# Altium project stmg431rb.PrjPcb
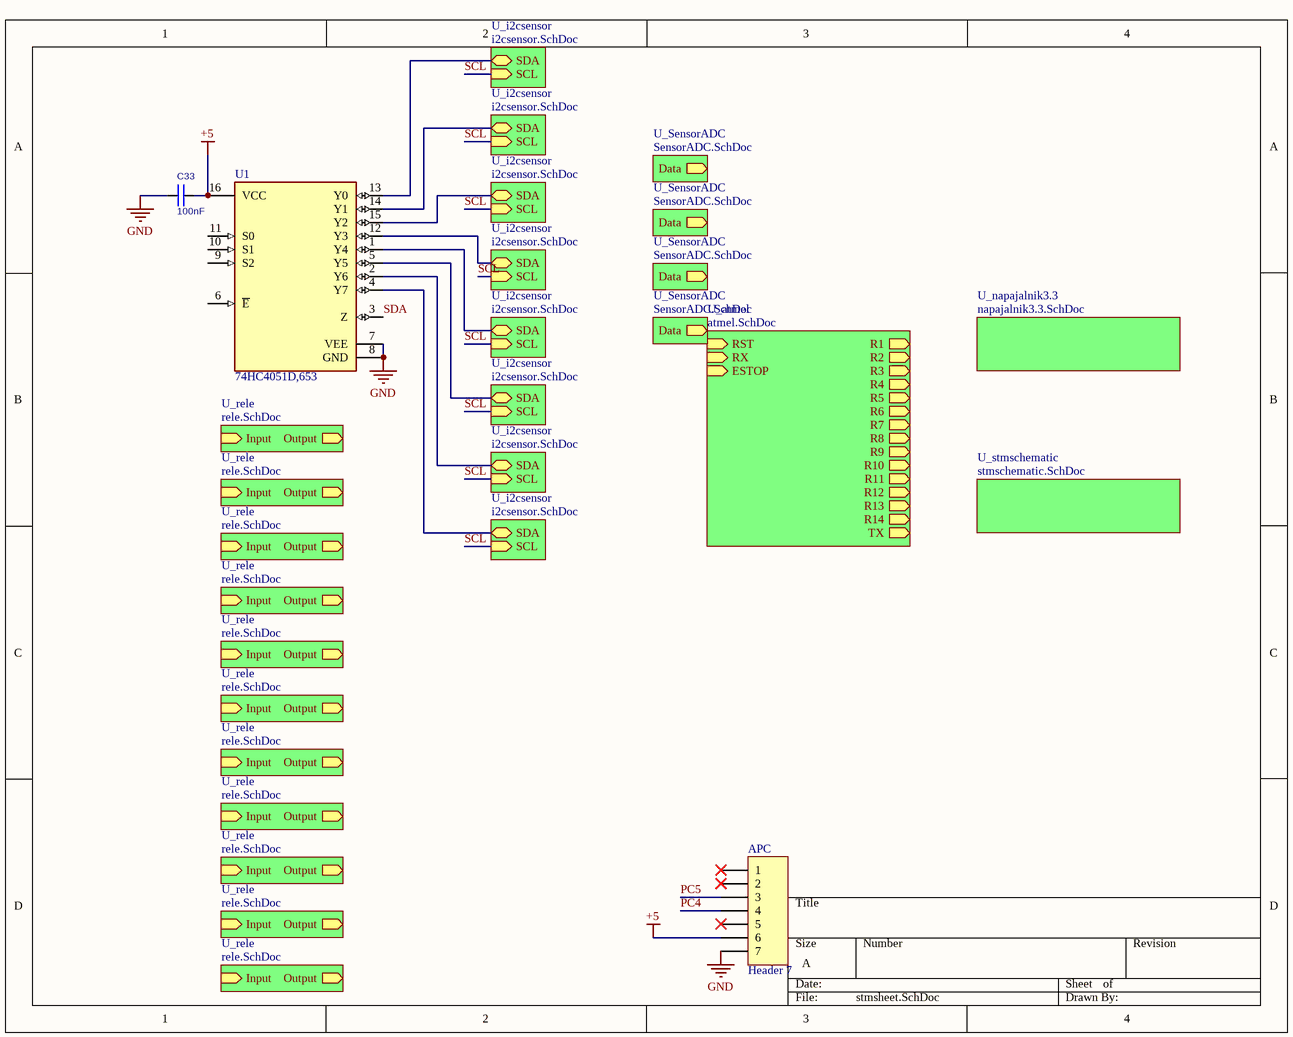
[diagram p0: stmsheet.SchDoc]
8 sheets, 154 parts. Net scope: hierarchical (ports join the sheet entries above them; power ports are global).
Board file: stmsheet.PcbDoc
Sheets:
  stmsheet.SchDoc
    U_atmel = atmel.SchDoc
    U_rele = rele.SchDoc
    U_rele = rele.SchDoc
    U_rele = rele.SchDoc
    U_rele = rele.SchDoc
    U_rele = rele.SchDoc
    U_rele = rele.SchDoc
    U_rele = rele.SchDoc
    U_rele = rele.SchDoc
    U_rele = rele.SchDoc
    U_rele = rele.SchDoc
    U_rele = rele.SchDoc
    U_SensorADC = SensorADC.SchDoc
    U_SensorADC = SensorADC.SchDoc
    U_SensorADC = SensorADC.SchDoc
    U_SensorADC = SensorADC.SchDoc
    U_napajalnik3.3 = napajalnik3.3.SchDoc
    U_i2csensor = i2csensor.SchDoc
    U_i2csensor = i2csensor.SchDoc
    U_i2csensor = i2csensor.SchDoc
    U_i2csensor = i2csensor.SchDoc
    U_i2csensor = i2csensor.SchDoc
    U_i2csensor = i2csensor.SchDoc
    U_i2csensor = i2csensor.SchDoc
    U_i2csensor = i2csensor.SchDoc
    U_stmschematic = stmschematic.SchDoc
      U_CAN = CAN.SchDoc

## Sheet stmsheet.SchDoc
size A; SheetNumber: 1; SheetTotal: 8

### Parts
APC  Header 7  [HDR1X7]
C33  100nF  [C0603]
U1  74HC4051D,653  [FP-SOT109-1-IPC_B]

### Sub-sheets
U_atmel = atmel.SchDoc: RST (in), R6 (out), R4 (out), R5 (out), R8 (out), R2 (out), R3 (out), R1 (out), R7 (out), TX (out), RX (in), ESTOP (in), R9 (out), R10 (out), R11 (out), R12 (out), R13 (out), R14 (out)
U_i2csensor = i2csensor.SchDoc: SDA (bidir), SCL (in)
U_i2csensor = i2csensor.SchDoc: SDA (bidir), SCL (in)
U_i2csensor = i2csensor.SchDoc: SDA (bidir), SCL (in)
U_i2csensor = i2csensor.SchDoc: SDA (bidir), SCL (in)
U_i2csensor = i2csensor.SchDoc: SDA (bidir), SCL (in)
U_i2csensor = i2csensor.SchDoc: SDA (bidir), SCL (in)
U_i2csensor = i2csensor.SchDoc: SDA (bidir), SCL (in)
U_i2csensor = i2csensor.SchDoc: SDA (bidir), SCL (in)
U_napajalnik3.3 = napajalnik3.3.SchDoc: no entries
U_rele = rele.SchDoc: Input (in), Output (out)
U_rele = rele.SchDoc: Input (in), Output (out)
U_rele = rele.SchDoc: Input (in), Output (out)
U_rele = rele.SchDoc: Input (in), Output (out)
U_rele = rele.SchDoc: Input (in), Output (out)
U_rele = rele.SchDoc: Input (in), Output (out)
U_rele = rele.SchDoc: Input (in), Output (out)
U_rele = rele.SchDoc: Input (in), Output (out)
U_rele = rele.SchDoc: Input (in), Output (out)
U_rele = rele.SchDoc: Input (in), Output (out)
U_rele = rele.SchDoc: Input (in), Output (out)
U_SensorADC = SensorADC.SchDoc: Data (out)
U_SensorADC = SensorADC.SchDoc: Data (out)
U_SensorADC = SensorADC.SchDoc: Data (out)
U_SensorADC = SensorADC.SchDoc: Data (out)
U_stmschematic = stmschematic.SchDoc: no entries

### Nets
+5: APC.6 C33.2 U1.16(VCC)
GND: APC.7 C33.1 U1.7(VEE) U1.8(GND)
PC4: APC.4
PC5: APC.3
SCL: sheet U_i2csensor/SCL, sheet U_i2csensor/SCL, sheet U_i2csensor/SCL, sheet U_i2csensor/SCL, sheet U_i2csensor/SCL, sheet U_i2csensor/SCL, sheet U_i2csensor/SCL, sheet U_i2csensor/SCL
SDA: U1.3(Z)
Netpressure1_U_i2csensor1_1: U1.13(Y0) ; sheet U_i2csensor/SDA
Netpressure1_U_i2csensor2_1: U1.14(Y1) ; sheet U_i2csensor/SDA
Netpressure1_U_i2csensor3_1: U1.15(Y2) ; sheet U_i2csensor/SDA
Netpressure1_U_i2csensor4_1: U1.12(Y3) ; sheet U_i2csensor/SDA
Netpressure1_U_i2csensor5_1: U1.1(Y4) ; sheet U_i2csensor/SDA
Netpressure1_U_i2csensor6_1: U1.5(Y5) ; sheet U_i2csensor/SDA
Netpressure1_U_i2csensor7_1: U1.2(Y6) ; sheet U_i2csensor/SDA
Netpressure1_U_i2csensor8_1: U1.4(Y7) ; sheet U_i2csensor/SDA

Not connected (* = marked no-connect by the designer): APC 1* 2* 5*; U1 6(~{E}) 9(S2) 10(S1) 11(S0)

### Library data of the parts
APC = Header 7: Header, 7-Pin; LatestRevisionDate: 17-Jul-2002; LatestRevisionNote: Re-released for DXP Platform.; Publisher: Altium Limited
C33 = C: Capacitor; Value: 100nF
U1 = CMP-14339-000003-1: IC MUX/DEMUX 8X1 16SOIC

## Sheet atmel.SchDoc
size A4; SheetNumber: 4; SheetTotal: 7; SPICEModelCacheDHJLCGBX: <root> / <DocumentId>DHJLCGBX</DocumentId> / <CacheFrame Number="0"> / <Model Name="0603_150060as75000" Kind="CKT"> / <Text>************************************************** / * Manufacturer:           Wurth Elektronik / * Kinds:                  SMT Mono-color Chip LED Waterclear / * Matchcode:              WL-SMCW / * Library Type:           LTspice / * Version:                rev22a / * Created/modified by:    Ella / * Date and Time:          2022-02-18 / * Team:                   eiSos EDA Service / * Contact:                libraries@we-online.com / ************************************************** / * Copyright(C) 2022 WĂĽrth Elektronik eiSos GmbH &amp; Co. KG / * All Rights Reserved. / ************************************************** / * Disclaimer: While WĂĽrth Elektronik eiSos has made every reasonable effort to ensure the accuracy / * of the simulation models provided, WĂĽrth Elektronik eiSos does not guarantee the exemption of error on / * the simulation models, nor does WĂĽrth Elektronik eiSos guarantee that the simulation model is current. / * WĂĽrth Elektronik eiSos reserves the right to make any adjustments at any time without notice. / * WĂĽrth Elektronik eiSos expressly disclaims all implied warranties regarding this simulation model. / ************************************************** / .subckt 0603_150060AS75000  1  2 / D1 1 2 SMCW / .MODEL SMCW D / + IS=10.010E-21 / + N=1.8643 / + RS=1.0000E-6 / + IKF=999 / + CJO=1.0000E-12 / + M=.3333 / + VJ=.75 / + BV=100 / + TT=5.0000E-9 / .ends</Text> / </Model> / </CacheFrame> / </root>
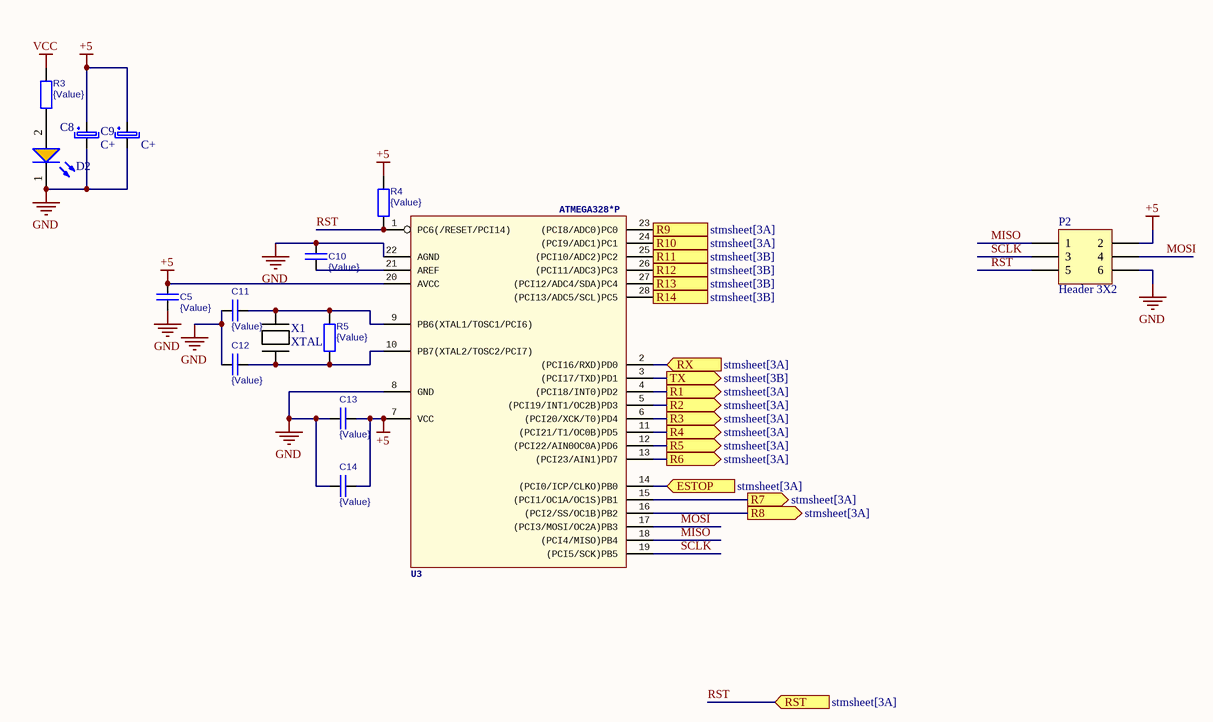
[diagram p1: atmel.SchDoc]

### Parts
(Parts that share a designator on the sheet are numbered #1, #2 ... from top to bottom, then left to right.)
C5  {Value}  [C0603]
C8  C+  [C AlElko 5x11 R2]
C9  C+  [C AlElko 5x11 R2]
C10  {Value}  [C0603]
C11  {Value}  [C0603]
C12  {Value}  [C0603]
C13  {Value}  [C0603]
C14  {Value}  [C0603]
D2  Amber, 2V, 140°  [WL-SMCW_0603_150060xx75000]  (value not drawn)
P2  Header 3X2  [HDR2X3]
R3#1  {Value}  [R0603]
R4  {Value}  [R0603]
R5  {Value}  [R0603]
U3  ATMEGA328*P  [DIL28-3]
X1  XTAL  [XTAL]

### Ports
ESTOP (in, see stmsheet[3A]), R1 (out, see stmsheet[3A]), R2 (out, see stmsheet[3A]), R3 (out, see stmsheet[3A]), R4 (out, see stmsheet[3A]), R5 (out, see stmsheet[3A]), R6 (out, see stmsheet[3A]), R7 (out, see stmsheet[3A]), R8 (out, see stmsheet[3A]), R9 (out, see stmsheet[3A]), R10 (out, see stmsheet[3A]), R11 (out, see stmsheet[3B]), R12 (out, see stmsheet[3B]), R13 (out, see stmsheet[3B]), R14 (out, see stmsheet[3B]), RST (in, see stmsheet[3A]), RX (in, see stmsheet[3A]), TX (out, see stmsheet[3B])

### Nets
+5: C5.1 C8.1 C9.1 C13.2 C14.2 P2.2 R4.1 U3.7(VCC) U3.20(AVCC)
GND: C5.2 C8.2 C9.2 C10.1 C11.1 C12.1 C13.1 C14.1 D2.1(K) P2.6 U3.8(GND) U3.22(AGND)
VCC: R3#1.1
MISO: P2.1 U3.18((PCI4/MISO)PB4)
MOSI: P2.4 U3.17((PCI3/MOSI/OC2A)PB3)
RST: P2.5 R4.2 U3.1(PC6(/RESET/PCI14)) ; port RST
SCLK: P2.3 U3.19((PCI5/SCK)PB5)
NetC10_2: C10.2 U3.21(AREF)
NetC11_2: C11.2 R5.1 U3.9(PB6(XTAL1/TOSC1/PCI6)) X1.2
NetC12_2: C12.2 R5.2 U3.10(PB7(XTAL2/TOSC2/PCI7)) X1.1
NetD2_2: D2.2(A) R3#1.2
NetU3_2: U3.2((PCI16/RXD)PD0) ; port RX
NetU3_3: U3.3((PCI17/TXD)PD1) ; port TX
NetU3_4: U3.4((PCI18/INT0)PD2) ; port R1
NetU3_5: U3.5((PCI19/INT1/OC2B)PD3) ; port R2
NetU3_6: U3.6((PCI20/XCK/T0)PD4) ; port R3
NetU3_11: U3.11((PCI21/T1/OC0B)PD5) ; port R4
NetU3_12: U3.12((PCI22/AIN0OC0A)PD6) ; port R5
NetU3_13: U3.13((PCI23/AIN1)PD7) ; port R6
NetU3_14: U3.14((PCI0/ICP/CLKO)PB0) ; port ESTOP
NetU3_15: U3.15((PCI1/OC1A/OC1S)PB1) ; port R7
NetU3_16: U3.16((PCI2/SS/OC1B)PB2) ; port R8
NetU3_23: U3.23((PCI8/ADC0)PC0) ; port R9
NetU3_24: U3.24((PCI9/ADC1)PC1) ; port R10
NetU3_25: U3.25((PCI10/ADC2)PC2) ; port R11
NetU3_26: U3.26((PCI11/ADC3)PC3) ; port R12
NetU3_27: U3.27((PCI12/ADC4/SDA)PC4) ; port R13
NetU3_28: U3.28((PCI13/ADC5/SCL)PC5) ; port R14

### Library data of the parts
C5 C10-C14 = C: Capacitor; Value: {Value}
C8 C9 = C+: Capacitor Polarized
D2 = 150060AS75000: WL-SMCW Mono-color Chip LED Waterclear, size 0603, Amber, 2V, 140°; Manufacturer: Wurth Elektronik; Case/Size Code: 0603; Chip Technology: AlInGaP; Dominant Wavelength: 605nm; Luminous Intensity: 130mcd; Peak Wavelength: 610nm; Manufacturer Part Number: 150060AS75000; Category: Signal LEDs; Match Code: WL-SMCW; ComponentLink1Description: Website Link; ComponentLink1URL: https://www.we-online.com/redexpert/article/150060AS75000?ad; ComponentLink2Description: Datasheet Link; ComponentLink2URL: https://www.we-online.com/redexpert/spec/150060AS75000?ad; Mount: Surface Mount; Operating Temperature Max: 85°C; Operating Temperature Min: -40°C; Packaging: Tape and Reel; Length: 1.6mm; Width: 0.8mm; Height: 0.7mm; Emitting Color: Amber; Forward Voltage: 2V; Viewing Angle: 140°
P2 = Header 3X2: Header, 3-Pin, Dual row; LatestRevisionDate: 17-Jul-2002; LatestRevisionNote: Re-released for DXP Platform.; Publisher: Altium Limited
R3#1 R4 R5 = R: Value: {Value}
U3 = ATMEGA328*P: GateName_1: G$1; SymbolName_1: MEGA328; LibraryName: atmega328; DeviceSetName: ATMEGA328*P; Package: DIL28-3

## Sheet rele.SchDoc
size A4; SheetNumber: 3; SheetTotal: 7
Used 11 times, as channels U_rele, U_rele, U_rele, U_rele, U_rele, U_rele, U_rele, U_rele, U_rele, U_rele, U_rele. Parts and nets are listed once, with the designators drawn on the sheet.
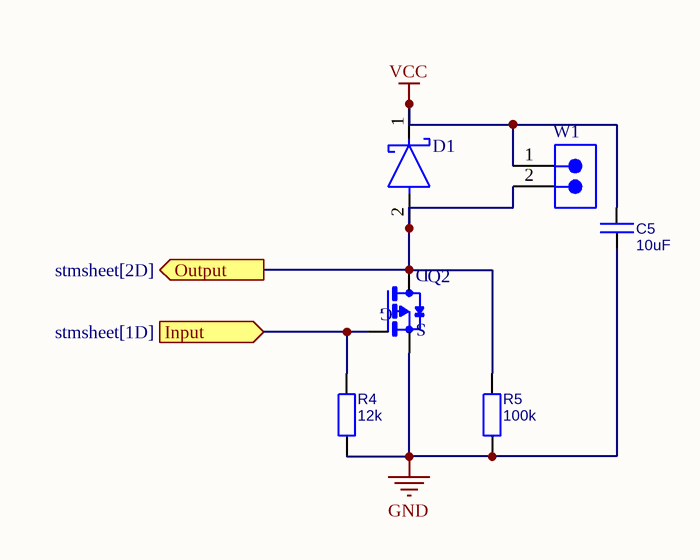
[diagram p2: rele.SchDoc]

### Parts
C5  10uF  [C0603]
D1  STPS0560Z  [FP-SOD-123-MFG]  (value not drawn)
Q2  SI2323DS-T1-GE3  [SOT23]  (value not drawn)
R4  12k  [R0603]
R5  100k  [R0603]
W1  (no value)  [691321100002]

### Ports
Input (in, see stmsheet[1D]), Output (out, see stmsheet[2D])

### Nets
GND: C5.2 Q2.2(S) R4.2 R5.2
VCC: C5.1 D1.1(C) W1.1
Input: Q2.1(G) R4.1 ; port Input
Output: D1.2(A) Q2.3(D) R5.1 W1.2 ; port Output

### Channels
U_rele: designators C5=C5_U_rele11 D1=D1_U_rele11 Q2=Q2_U_rele#1 R4=R4_U_rele11 R5=R5_U_rele11 W1=W1_U_rele11; ports Input=NetQ2_U_rele#1_1 Output=NetD1_U_rele11_2
U_rele: designators C5=C5_U_rele10 D1=D1_U_rele10 Q2=Q2_U_rele#2 R4=R4_U_rele10 R5=R5_U_rele10 W1=W1_U_rele10; ports Input=NetQ2_U_rele#2_1 Output=NetD1_U_rele10_2
U_rele: designators C5=C5_U_rele9 D1=D1_U_rele9 Q2=Q2_U_rele#3 R4=R4_U_rele9 R5=R5_U_rele9 W1=W1_U_rele9; ports Input=NetQ2_U_rele#3_1 Output=NetD1_U_rele9_2
U_rele: designators C5=C5_U_rele8 D1=D1_U_rele8 Q2=Q2_U_rele#4 R4=R4_U_rele8 R5=R5_U_rele8 W1=W1_U_rele8; ports Input=NetQ2_U_rele#4_1 Output=NetD1_U_rele8_2
U_rele: designators C5=C5_U_rele7 D1=D1_U_rele7 Q2=Q2_U_rele#5 R4=R4_U_rele7 R5=R5_U_rele7 W1=W1_U_rele7; ports Input=NetQ2_U_rele#5_1 Output=NetD1_U_rele7_2
U_rele: designators C5=C5_U_rele6 D1=D1_U_rele6 Q2=Q2_U_rele#6 R4=R4_U_rele6 R5=R5_U_rele6 W1=W1_U_rele6; ports Input=NetQ2_U_rele#6_1 Output=NetD1_U_rele6_2
U_rele: designators C5=C5_U_rele5 D1=D1_U_rele5 Q2=Q2_U_rele#7 R4=R4_U_rele5 R5=R5_U_rele5 W1=W1_U_rele5; ports Input=NetQ2_U_rele#7_1 Output=NetD1_U_rele5_2
U_rele: designators C5=C5_U_rele4 D1=D1_U_rele4 Q2=Q2_U_rele#8 R4=R4_U_rele4 R5=R5_U_rele4 W1=W1_U_rele4; ports Input=NetQ2_U_rele#8_1 Output=NetD1_U_rele4_2
U_rele: designators C5=C5_U_rele3 D1=D1_U_rele3 Q2=Q2_U_rele#9 R4=R4_U_rele3 R5=R5_U_rele3 W1=W1_U_rele3; ports Input=NetQ2_U_rele#9_1 Output=NetD1_U_rele3_2
U_rele: designators C5=C5_U_rele2 D1=D1_U_rele2 Q2=Q2_U_rele#10 R4=R4_U_rele2 R5=R5_U_rele2 W1=W1_U_rele2; ports Input=NetQ2_U_rele#10_1 Output=NetD1_U_rele2_2
U_rele: designators C5=C5_U_rele1 D1=D1_U_rele1 Q2=Q2_U_rele#11 R4=R4_U_rele1 R5=R5_U_rele1 W1=W1_U_rele1; ports Input=NetQ2_U_rele#11_1 Output=NetD1_U_rele1_2

### Library data of the parts
C5 = C: Capacitor; Value: 10uF
D1 = CMP-12187-000036-1: DIODE SCHOTTKY 60V 500MA SOD123; Additional Feature: FREE WHEELING DIODE; Polarity: Standard; Max Forward Surge Current (Ifsm): 5.5A; Number of Elements: 1; Max Reverse Current: 50uA; Diode Element Material: SILICON; Number of Terminals/Pins: 2; Package Body Material: Plastic; Element Configuration: Single; Forward Voltage: 660mV; Terminal Form: Gull Wing; Output Current: 500mA; Series: -; Package Quantity: 1; Max Reverse Voltage (DC): 60V; Width: 1.7mm; Voltage Rating (DC): 60V; Height: 1.35mm; Packaging: Tape and Reel; Max Repetitive Reverse Voltage (Vrrm): 60V; Max Surge Current: 5.5A; Package Shape: Rectangular; REACH SVHC: No SVHC; Average Rectified Current: 500mA; JESD-30 Code: R-PDSO-G2; Terminal Position: DUAL; RoHS Compliant: Yes; Surface Mount: Yes; Peak Non-Repetitive Surge Current: 5.5A; Contact Plating: Tin; Max Reverse Leakage Current: 50uA; Length: 2.85mm; Number of Pins: 2; Radiation Hardening: No; Mount: Surface Mount; Forward Current: 500mA; Max Operating Temperature: 150°C; Min Operating Temperature: -65°C; Weight: 0.01lb; Lead Free: Lead Free; Technology: SCHOTTKY; Current Rating: 500mA
Q2 = SI2323DS-T1-GE3: P-Channel 20V 3.7A (Ta) 750mW (Ta) Surface Mount SOT-23-3 (TO-236); MF: Vishay; Package: SOT-23-3 Vishay; Price: None; Value: *; SnapEDA_Link: https://www.snapeda.com/parts/SI2323DS-T1-GE3/Vishay%20Siliconix/view-part/1098074/?ref=snap; MP: SI2323DS-T1-GE3; Availability: Unavailable
R4 R5 = R
  R4: Value: 12k
  R5: Value: 100k
W1 = CMP-1502-01783-2: NexarPartId: 18818340; Current Rating: 10A; Voltage: 300V; Pitch: 3.5052mm; Number of Contacts: 2; Number of Levels: 1; Gender: Male; Termination: Solder; Lead Free: Lead Free; Number of Rows: 1; Contact Material: Brass; Width: 8.1mm; Length: 7mm; Voltage Rating: 300V; Min Operating Temperature: -40°C; Number of Pins: 2; Height: 7.2mm; Mount: Through Hole; Max Operating Temperature: 105°C; RoHS: Compliant; Orientation: Vertical; Number of Positions Per Level: 2; Current: 10A; REACH SVHC: Unknown; Color: Green; Lead Pitch: 3.5mm; Packaging: Box

## Sheet SensorADC.SchDoc
size A; SheetNumber: 5; SheetTotal: 8
Used 4 times, as channels U_SensorADC, U_SensorADC, U_SensorADC, U_SensorADC. Parts and nets are listed once, with the designators drawn on the sheet.
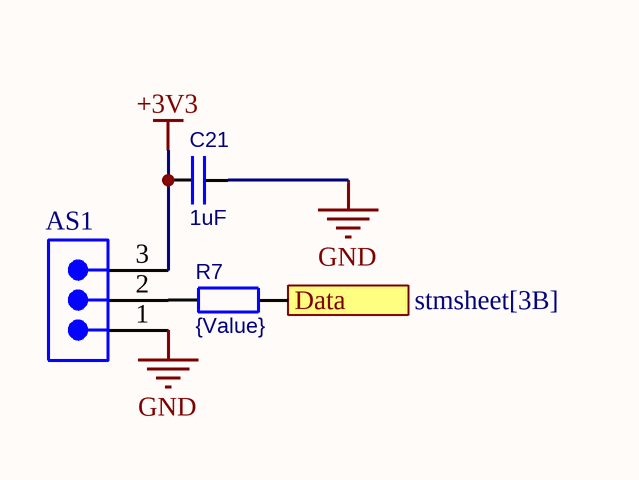
[diagram p3: SensorADC.SchDoc]

### Parts
AS1  (no value)  [691321100003]
C21  1uF  [C0603]
R7  {Value}  [R0603]

### Ports
Data (out, see stmsheet[3B])

### Nets
+3V3: AS1.3 C21.1
GND: AS1.1 C21.2
Data: R7.2 ; port Data
NetAS1_2: AS1.2 R7.1

### Channels
U_SensorADC: designators end in _U_SensorADC4; ports Data=NetR7_U_SensorADC4_2
U_SensorADC: designators end in _U_SensorADC3; ports Data=NetR7_U_SensorADC3_2
U_SensorADC: designators end in _U_SensorADC2; ports Data=NetR7_U_SensorADC2_2
U_SensorADC: designators end in _U_SensorADC1; ports Data=NetR7_U_SensorADC1_2

### Library data of the parts
AS1 = CMP-1502-01784-2: NexarPartId: 18818341; Pitch: 3.5052mm; Current Rating: 10.5A; Number of Positions Per Level: 3; Current: 10A; Voltage: 300V; Gender: Male; Number of Levels: 1; REACH SVHC: Unknown; Height: 12.7mm; Mount: Through Hole; RoHS: Compliant; Contact Gender: Male; Lead Free: Lead Free; Lead Pitch: 3.5mm; Orientation: Vertical; Width: 15.1mm; Color: Green; Number of Contacts: 3; Number of Rows: 1; Length: 7mm; Number of Pins: 3; Termination: Solder; Packaging: Box; Contact Material: Brass
C21 = C: Capacitor; Value: 1uF
R7 = R: Value: {Value}

## Sheet napajalnik3.3.SchDoc
size A; SheetNumber: 2; SheetTotal: 8
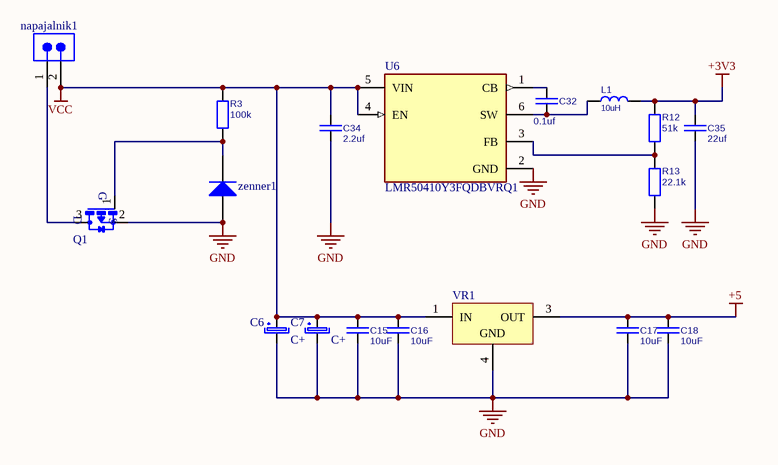
[diagram p4: napajalnik3.3.SchDoc]

### Parts
(Parts that share a designator on the sheet are numbered #1, #2 ... from top to bottom, then left to right.)
C6  C+  [C AlElko R2.54 FI5]
C7  C+  [C AlElko R2.54 FI5]
C15  10uF  [C0603]
C16  10uF  [C0603]
C17  10uF  [C0603]
C18  10uF  [C0603]
C32  0.1uf  [C0603]
C34  2.2uf  [C0603]
C35  22uf  [C0603]
L1  10uH  [R400]
napajalnik1  napajalnik  [691321100002]  (value not drawn)
Q1  SI2323DS-T1-GE3  [SOT23]  (value not drawn)
R3#2  value 100k  [R0603]  (hidden comment: R1)
R12  51k  [R0805]
R13  22.1k  [R0805]
U6  LMR50410Y3FQDBVRQ1  [FP-DBV0006A-IPC_C]
VR1  L7805ACD2T-TR  [TO-263_N]  (value not drawn)
zenner1  MMSZ5248B  [FAIR-SOD-123-2_V]  (value not drawn)

### Nets
+3V3: C35.1 L1.2 R12.1
+5: C17.1 C18.1 VR1.3(OUT)
GND: C6.2 C7.2 C15.2 C16.2 C17.2 C18.2 C34.2 C35.2 Q1.2(S) R13.2 U6.2(GND) VR1.4(GND) zenner1.1(A)
VCC: C6.1 C7.1 C15.1 C16.1 C34.1 napajalnik1.2 R3#2.1 U6.4(EN) U6.5(VIN) VR1.1(IN)
NetC32_1: C32.1 U6.1(CB)
NetC32_2: C32.2 L1.1 U6.6(SW)
Netnapajalnik1_1: napajalnik1.1 Q1.3(D)
NetQ1_1: Q1.1(G) R3#2.2 zenner1.2(K)
NetR12_2: R12.2 R13.1 U6.3(FB)

### Library data of the parts
C6 C7 = C+: Capacitor Polarized
C15-C18 C32 C34 C35 = C: Capacitor
  C15-C18: Value: 10uF
  C32: Value: 0.1uf
  C34: Value: 2.2uf
  C35: Value: 22uf
L1 = L: Value: 10uH
napajalnik1 = CMP-1502-01783-2: as W1 on sheet rele; Termination: Solder; Lead Free: Lead Free; Number of Rows: 1; Contact Material: Brass; Width: 8.1mm; Length: 7mm; Voltage Rating: 300V; Min Operating Temperature: -40°C; Number of Pins: 2; Height: 7.2mm; Mount: Through Hole; Max Operating Temperature: 105°C; RoHS: Compliant; Orientation: Vertical; Number of Positions Per Level: 2; Current: 10A; REACH SVHC: Unknown; Color: Green; Lead Pitch: 3.5mm; Packaging: Box
Q1 = SI2323DS-T1-GE3: as Q2 on sheet rele; Package: SOT-23-3 Vishay; Price: None; Value: *; SnapEDA_Link: https://www.snapeda.com/parts/SI2323DS-T1-GE3/Vishay%20Siliconix/view-part/1098074/?ref=snap; MP: SI2323DS-T1-GE3; Availability: Unavailable
R3#2 R12 R13 = R
  R12: Value: 51k
  R13: Value: 22.1k
U6 = CMP-04918-000634-1: AUTOMOTIVE QUALIFIED SIMPLE SWIT
VR1 = CMP-0244-00214-1: Positive Voltage Regulator, 3-Pin D2PAK, Tape and Reel; DatasheetVersion: 16/11/2011; PackageVersion: 2011; PackageReference: TO-263; PackageDescription: 3-Pin Transistor Outline Package 2.54 mm Pitch, 15.4 mm Lead Span (D2PAK); ComponentLink2URL: http://www.st.com/internet/com/TECHNICAL_RESOURCES/TECHNICAL_LITERATURE/DATASHEET/CD00000444.pdf; ComponentLink1URL: http://www.st.com; ComponentLink1Description: Manufacturer URL; ComponentLink2Description: Datasheet
zenner1 = CMP-2000-06744-1: Zener Diode, 18 V, -55 to 150 degC, 2-Pin SOD-123, RoHS, Tape and Reel; Manufacturer: FairchildSemiconductor; Manuf. Code: FSC; Residual reverse leakage current: 0.1µA; Max. power: 500mW; Enclosure: SOD123; Impedance reference: 7mA; Configuration: 1diode; Uz(min.): 17.1V; Forward voltage reference: 10mA; UF: 900mV; Zener voltage: 18V; Uz (max.): 18.9V; Impedance: 21Ω; Category: Zenerdiode; Package Description: 2-Pin Surface Mount Device, Body 2.7 x 1.6 mm; Type: MMSZ5248B; Manufacturer URL: https://www.fairchildsemi.com/; Operating temperature (min.): -55°C; Datasheet URL: https://www.fairchildsemi.com/datasheets/MM/MMSZ5226B.pdf; Mounting type: Surface-mount; Max. operating temperature: +150°C; Mounting Technology: SurfaceMount; Datasheet Version: Rev. 1.6, 10/2015; Package Reference: SOD-123-2

## Sheet i2csensor.SchDoc
size A4; SheetNumber: 6; SheetTotal: 7
Used 8 times, as channels U_i2csensor, U_i2csensor, U_i2csensor, U_i2csensor, U_i2csensor, U_i2csensor, U_i2csensor, U_i2csensor. Parts and nets are listed once, with the designators drawn on the sheet.
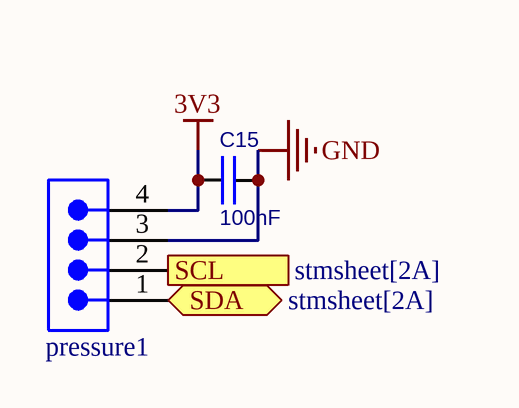
[diagram p5: i2csensor.SchDoc]

### Parts
C15  100nF  [C0603]
pressure1  COM&Heart  [691321100004]  (value not drawn)

### Ports
SCL (in, see stmsheet[2A]), SDA (bidir, see stmsheet[2A])

### Nets
3V3: C15.1 pressure1.4
GND: C15.2 pressure1.3
SCL: pressure1.2 ; port SCL
SDA: pressure1.1 ; port SDA

### Channels
U_i2csensor: designators end in _U_i2csensor8; ports SCL=SCL SDA=Netpressure1_U_i2csensor8_1
U_i2csensor: designators end in _U_i2csensor7; ports SCL=SCL SDA=Netpressure1_U_i2csensor7_1
U_i2csensor: designators end in _U_i2csensor6; ports SCL=SCL SDA=Netpressure1_U_i2csensor6_1
U_i2csensor: designators end in _U_i2csensor5; ports SCL=SCL SDA=Netpressure1_U_i2csensor5_1
U_i2csensor: designators end in _U_i2csensor4; ports SCL=SCL SDA=Netpressure1_U_i2csensor4_1
U_i2csensor: designators end in _U_i2csensor3; ports SCL=SCL SDA=Netpressure1_U_i2csensor3_1
U_i2csensor: designators end in _U_i2csensor2; ports SCL=SCL SDA=Netpressure1_U_i2csensor2_1
U_i2csensor: designators end in _U_i2csensor1; ports SCL=SCL SDA=Netpressure1_U_i2csensor1_1

### Library data of the parts
C15 = C: Capacitor; Value: 100nF
pressure1 = CMP-1502-01785-2: NexarPartId: 18818342; Number of Contacts: 4; Voltage Rating: 300V; Current Rating: 10.5A; Number of Levels: 1; Gender: Male; Current: 10A; Pitch: 3.5052mm; Width: 18.6mm; Orientation: Vertical; Lead Pitch: 3.5mm; Voltage: 300V; Mount: Through Hole; Termination: Solder; Contact Material: Brass; Height: 9.4mm; Length: 7mm; RoHS: Compliant; Min Operating Temperature: -40°C; Number of Pins: 4; Max Operating Temperature: 105°C; REACH SVHC: Unknown; Packaging: Box; Number of Rows: 1; Number of Positions Per Level: 4; Lead Free: Lead Free; Color: Green

## Sheet stmschematic.SchDoc
size A; SheetNumber: 7; SheetTotal: 8
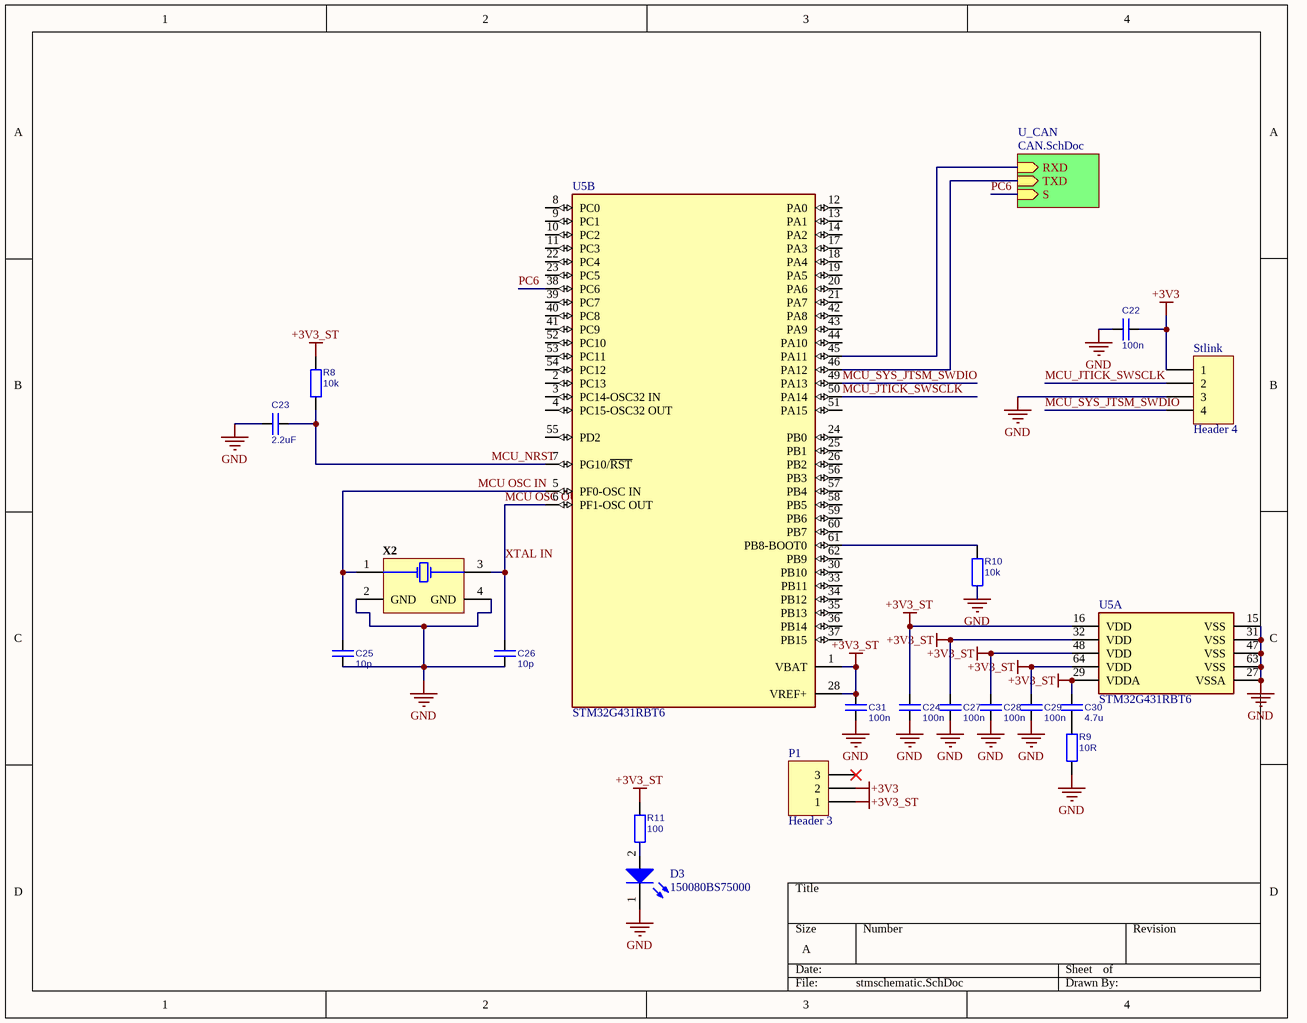
[diagram p6: stmschematic.SchDoc]

### Parts
C22  100n  [C0603]
C23  2.2uF  [C0603]
C24  100n  [C0603]
C25  10p  [C0603]
C26  10p  [C0603]
C27  100n  [C0603]
C28  100n  [C0603]
C29  100n  [C0603]
C30  4.7u  [C0603]
C31  100n  [C0603]
D3  150080BS75000  [WL-SMCW_0805_150080xx75000]
P1  Header 3  [HDR1X3]
R8  10k  [R0603]
R9  10R  [R0603]
R10  10k  [R0603]
R11  100  [R0603]
Stlink  Header 4  [HDR1X4]
U5  STM32G431RBT6  [FP-LQFP64-5W-MFG]  (parts A,B of 2)
X2  TSX-3225 24.0000MF15X-AC3  [EPSON-TSX-3225_V]  (value not drawn)

### Sub-sheets
U_CAN = CAN.SchDoc: RXD (in), TXD (in), S (in)

### Nets
+3V3: C22.2 P1.2 Stlink.1
+3V3_ST: C24.1 C27.1 C28.1 C29.1 C30.1 C31.1 P1.1 R8.1 R11.2 U5.1(VBAT) U5.16(VDD) U5.28(VREF+) U5.29(VDDA) U5.32(VDD) U5.48(VDD) U5.64(VDD)
GND: C22.1 C23.1 C24.2 C25.2 C26.2 C27.2 C28.2 C29.2 C31.2 D3.1(K) R9.2 R10.2 Stlink.3 U5.15(VSS) U5.27(VSSA) U5.31(VSS) U5.47(VSS) U5.63(VSS) X2.2(GND) X2.4(GND)
MCU OSC IN: C25.1 U5.5(PF0-OSC_IN) X2.1(X1)
MCU OSC OUT: C26.1 U5.6(PF1-OSC_OUT) X2.3(X2)  [also labelled XTAL IN]
MCU_JTICK_SWSCLK: Stlink.2 U5.50(PA14)
MCU_NRST: C23.2 R8.2 U5.7(PG10/~{RST})
MCU_SYS_JTSM_SWDIO: Stlink.4 U5.49(PA13)
PC6: U5.38(PC6) ; sheet U_CAN/S
NetC30_2: C30.2 R9.1
NetD3_2: D3.2(A) R11.1
NetR10_1: R10.1 U5.61(PB8-BOOT0)
NetU5_45: U5.45(PA11) ; sheet U_CAN/RXD
NetU5_46: U5.46(PA12) ; sheet U_CAN/TXD

Not connected (* = marked no-connect by the designer): P1 3*; U5 2(PC13) 3(PC14-OSC32_IN) 4(PC15-OSC32_OUT) 8(PC0) 9(PC1) 10(PC2) 11(PC3) 12(PA0) 13(PA1) 14(PA2) 17(PA3) 18(PA4) 19(PA5) 20(PA6) 21(PA7) 22(PC4) 23(PC5) 24(PB0) 25(PB1) 26(PB2) 30(PB10) 33(PB11) 34(PB12) 35(PB13) 36(PB14) 37(PB15) 39(PC7) 40(PC8) 41(PC9) 42(PA8) 43(PA9) 44(PA10) 51(PA15) 52(PC10) 53(PC11) 54(PC12) 55(PD2) 56(PB3) 57(PB4) 58(PB5) 59(PB6) 60(PB7) 62(PB9)

### Library data of the parts
C22-C31 = C: Capacitor
  C22 C24 C27-C29 C31: Value: 100n
  C23: Value: 2.2uF
  C25 C26: Value: 10p
  C30: Value: 4.7u
D3 = CMP-1426-00008-6: NexarPartId: 29717779; Test Current: 20mA; Lens Style: Clear, Rectangular; Forward Current: 100mA; Power Dissipation: 105mW; Dominant Wavelength: 470nm; Reverse Voltage: 5V; Viewing Angle: 140°; Luminous Intensity: 145mcd; Color: Blue; Forward Voltage: 3.2V; Max Junction Temperature (Tj): 95°C; Peak Wavelength: 465nm; Min Operating Temperature: -40°C; Mount: Surface Mount; Case Code (Imperial): 0805; Packaging: Tape and Reel; Lead Free: Lead Free; Length: 2mm; Case/Package: 0805; Case Code (Metric): 2012; Max Operating Temperature: 85°C; Height: 700µm; RoHS: Compliant; Max Reverse Voltage (DC): 5V; REACH SVHC: Unknown; Width: 1.25mm; Wavelength: 470nm
P1 = Header 3: Header, 3-Pin; LatestRevisionDate: 17-Jul-2002; LatestRevisionNote: Re-released for DXP Platform.; Publisher: Altium Limited
R8-R11 = R
  R8 R10: Value: 10k
  R9: Value: 10R
  R11: Value: 100
Stlink = Header 4: Header, 4-Pin; LatestRevisionDate: 17-Jul-2002; LatestRevisionNote: Re-released for DXP Platform.; Publisher: Altium Limited
U5 = CMP-12105-000150-1: IC MCU 32BIT 128KB FLASH 64LQFP; RoHS Compliant: Yes
X2 = CMP-2000-07333-1: MHz Range Crystal, 24 MHz, -40 to 85 degC, 4-Pin SMD, RoHS, Tape and Reel; Manufacturer: Epson; Brand: EpsonTiming; Frequency Stability: 10PPM; Frequency: 24MHz; ESR: 40Ohms; Load Capacitance: 9pF; Unit Weight: 0.000564oz; Drive Level: 200uW; Datasheet Version: 12/2015; RoHS: True; Operating Temperature Range: -40Cto+85C; Length: 3.2mm; Tolerance: 10PPM; Width: 2.5mm; Mounting Technology: SurfaceMount; Package Description: 4-Pin Surface Mount Device, Body 3.2 x 2.5 mm; Manufacturer URL: https://www.eea.epson.com/; Factory Pack Quantity: 250; Package Reference: TSX-3225; Height: 0.6mm; Mounting Style: SMD/SMT; Termination Style: SMD/SMT; Datasheet URL: https://support.epson.biz/td/api/doc_check.php?dl=brief_FA-238V_en.pdf; Type: Crystal; Series: TSX-3225; Package / Case: 3.2mmx2.5mm; Product Category: Crystals; Packaging: Reel

## Sheet CAN.SchDoc
size A; SheetNumber: 8; SheetTotal: 8
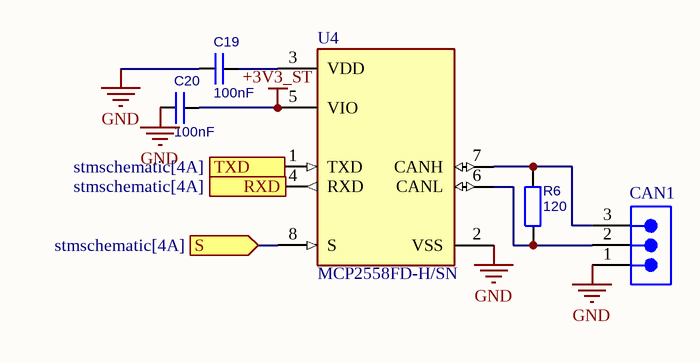
[diagram p7: CAN.SchDoc]

### Parts
C19  100nF  [C0603]
C20  100nF  [C0603]
CAN1  (no value)  [691321100003]
R6  120  [R0603]
U4  MCP2558FD-H/SN  [FP-C04-057-SN-MFG]

### Ports
RXD (in, see stmschematic[4A]), S (in, see stmschematic[4A]), TXD (out, see stmschematic[4A])

### Nets
+3V3_ST: C20.1 U4.5(VIO)
GND: C19.2 C20.2 CAN1.1 U4.2(VSS)
PC6: U4.8(S) ; port S
NetC19_1: C19.1 U4.3(VDD)
NetCAN1_2: CAN1.2 R6.2 U4.6(CANL)
NetCAN1_3: CAN1.3 R6.1 U4.7(CANH)

Not connected (* = marked no-connect by the designer): U4 1(TXD) 4(RXD)

### Library data of the parts
C19 C20 = C: Capacitor; Value: 100nF
CAN1 = CMP-1502-01784-2: as AS1 on sheet SensorADC; REACH SVHC: Unknown; Height: 12.7mm; Mount: Through Hole; RoHS: Compliant; Contact Gender: Male; Lead Free: Lead Free; Lead Pitch: 3.5mm; Orientation: Vertical; Width: 15.1mm; Color: Green; Number of Contacts: 3; Number of Rows: 1; Length: 7mm; Number of Pins: 3; Termination: Solder; Packaging: Box; Contact Material: Brass
R6 = R: Value: 120
U4 = CMP-06279-000003-1: IC TRANSCEIVER 1/1 8SOIC; Manufacturer: Microchip Technology; Max Supply Voltage: 5.5V; Interface: CAN; Nominal Supply Current: 2.5-95mA; Max Junction Temp: +175°C; Standoff Height: 0.1mm; Min Supply Voltage: 1.7V; Digikey Description: IC TRANSCEIVER 1/1 8SOIC; Device Class L1: Integrated Circuits (ICs); Temperature Range High: +150°C; Temperature: -40°C to +150°C; ComponentLink2URL: http://ww1.microchip.com/downloads/en/DeviceDoc/20005533A.pdf; Device Class L2: Interface ICs; Lead Free: Yes; ComponentLink2Description: Datasheet; Ambient Temperature Range Low: -40°C; Device Class L3: unset; Mouser Description: In a Pack of 10, Microchip Technology MCP2558FD-H/SN, CAN Transceiver 8Mbit/s 1-Channel CAN, 8-Pin SOIC; Manufacturer Part Number: MCP2558FD-H/SN; Category: IC; Octopart: https://octopart.com/mcp2558fd-h%2Fsn-microchip-71590966; Ambient Temperature Range High: +150°C; Automotive: No; RoHS: TRUE; Height: 1.75mm; Package: C04-057-SN; Footprint Url: http://ww1.microchip.com/downloads/en/DeviceDoc/08L_SOIC_150_3dot9mm_SN_C04-00057e.pdf; Temperature Range Low: -40°C

## Nets that join several sheets
3V3: U_i2csensor (C15_U_i2csensor8.1 pressure1_U_i2csensor8.4), U_i2csensor (C15_U_i2csensor7.1 pressure1_U_i2csensor7.4), U_i2csensor (C15_U_i2csensor6.1 pressure1_U_i2csensor6.4), U_i2csensor (C15_U_i2csensor5.1 pressure1_U_i2csensor5.4), U_i2csensor (C15_U_i2csensor4.1 pressure1_U_i2csensor4.4), U_i2csensor (C15_U_i2csensor3.1 pressure1_U_i2csensor3.4), U_i2csensor (C15_U_i2csensor2.1 pressure1_U_i2csensor2.4), U_i2csensor (C15_U_i2csensor1.1 pressure1_U_i2csensor1.4)
+3V3: U_SensorADC (AS1_U_SensorADC4.3 C21_U_SensorADC4.1), U_SensorADC (AS1_U_SensorADC3.3 C21_U_SensorADC3.1), U_SensorADC (AS1_U_SensorADC2.3 C21_U_SensorADC2.1), U_SensorADC (AS1_U_SensorADC1.3 C21_U_SensorADC1.1), napajalnik3.3 (C35.1 L1.2 R12.1), stmschematic (C22.2 P1.2 Stlink.1)
+3V3_ST: stmschematic (16 pins), CAN (C20.1 U4.5)
+5: stmsheet (APC.6 C33.2 U1.16), atmel (9 pins), napajalnik3.3 (C17.1 C18.1 VR1.3)
GND: stmsheet (APC.7 C33.1 U1.7 U1.8), atmel (12 pins), U_rele (C5_U_rele11.2 Q2_U_rele#1.2 R4_U_rele11.2 R5_U_rele11.2), U_rele (C5_U_rele10.2 Q2_U_rele#2.2 R4_U_rele10.2 R5_U_rele10.2), U_rele (C5_U_rele9.2 Q2_U_rele#3.2 R4_U_rele9.2 R5_U_rele9.2), U_rele (C5_U_rele8.2 Q2_U_rele#4.2 R4_U_rele8.2 R5_U_rele8.2), U_rele (C5_U_rele7.2 Q2_U_rele#5.2 R4_U_rele7.2 R5_U_rele7.2), U_rele (C5_U_rele6.2 Q2_U_rele#6.2 R4_U_rele6.2 R5_U_rele6.2), U_rele (C5_U_rele5.2 Q2_U_rele#7.2 R4_U_rele5.2 R5_U_rele5.2), U_rele (C5_U_rele4.2 Q2_U_rele#8.2 R4_U_rele4.2 R5_U_rele4.2), U_rele (C5_U_rele3.2 Q2_U_rele#9.2 R4_U_rele3.2 R5_U_rele3.2), U_rele (C5_U_rele2.2 Q2_U_rele#10.2 R4_U_rele2.2 R5_U_rele2.2), U_rele (C5_U_rele1.2 Q2_U_rele#11.2 R4_U_rele1.2 R5_U_rele1.2), U_SensorADC (AS1_U_SensorADC4.1 C21_U_SensorADC4.2), U_SensorADC (AS1_U_SensorADC3.1 C21_U_SensorADC3.2), U_SensorADC (AS1_U_SensorADC2.1 C21_U_SensorADC2.2), U_SensorADC (AS1_U_SensorADC1.1 C21_U_SensorADC1.2), napajalnik3.3 (13 pins), U_i2csensor (C15_U_i2csensor8.2 pressure1_U_i2csensor8.3), U_i2csensor (C15_U_i2csensor7.2 pressure1_U_i2csensor7.3), U_i2csensor (C15_U_i2csensor6.2 pressure1_U_i2csensor6.3), U_i2csensor (C15_U_i2csensor5.2 pressure1_U_i2csensor5.3), U_i2csensor (C15_U_i2csensor4.2 pressure1_U_i2csensor4.3), U_i2csensor (C15_U_i2csensor3.2 pressure1_U_i2csensor3.3), U_i2csensor (C15_U_i2csensor2.2 pressure1_U_i2csensor2.3), U_i2csensor (C15_U_i2csensor1.2 pressure1_U_i2csensor1.3), stmschematic (20 pins), CAN (C19.2 C20.2 CAN1.1 U4.2)
VCC: atmel (R3#1.1), U_rele (C5_U_rele11.1 D1_U_rele11.1 W1_U_rele11.1), U_rele (C5_U_rele10.1 D1_U_rele10.1 W1_U_rele10.1), U_rele (C5_U_rele9.1 D1_U_rele9.1 W1_U_rele9.1), U_rele (C5_U_rele8.1 D1_U_rele8.1 W1_U_rele8.1), U_rele (C5_U_rele7.1 D1_U_rele7.1 W1_U_rele7.1), U_rele (C5_U_rele6.1 D1_U_rele6.1 W1_U_rele6.1), U_rele (C5_U_rele5.1 D1_U_rele5.1 W1_U_rele5.1), U_rele (C5_U_rele4.1 D1_U_rele4.1 W1_U_rele4.1), U_rele (C5_U_rele3.1 D1_U_rele3.1 W1_U_rele3.1), U_rele (C5_U_rele2.1 D1_U_rele2.1 W1_U_rele2.1), U_rele (C5_U_rele1.1 D1_U_rele1.1 W1_U_rele1.1), napajalnik3.3 (10 pins)
Netpressure1_U_i2csensor1_1: stmsheet (U1.13), U_i2csensor (pressure1_U_i2csensor1.1)
Netpressure1_U_i2csensor2_1: stmsheet (U1.14), U_i2csensor (pressure1_U_i2csensor2.1)
Netpressure1_U_i2csensor3_1: stmsheet (U1.15), U_i2csensor (pressure1_U_i2csensor3.1)
Netpressure1_U_i2csensor4_1: stmsheet (U1.12), U_i2csensor (pressure1_U_i2csensor4.1)
Netpressure1_U_i2csensor5_1: stmsheet (U1.1), U_i2csensor (pressure1_U_i2csensor5.1)
Netpressure1_U_i2csensor6_1: stmsheet (U1.5), U_i2csensor (pressure1_U_i2csensor6.1)
Netpressure1_U_i2csensor7_1: stmsheet (U1.2), U_i2csensor (pressure1_U_i2csensor7.1)
Netpressure1_U_i2csensor8_1: stmsheet (U1.4), U_i2csensor (pressure1_U_i2csensor8.1)
PC6: stmschematic (U5.38), CAN (U4.8)
SCL: U_i2csensor (pressure1_U_i2csensor8.2), U_i2csensor (pressure1_U_i2csensor7.2), U_i2csensor (pressure1_U_i2csensor6.2), U_i2csensor (pressure1_U_i2csensor5.2), U_i2csensor (pressure1_U_i2csensor4.2), U_i2csensor (pressure1_U_i2csensor3.2), U_i2csensor (pressure1_U_i2csensor2.2), U_i2csensor (pressure1_U_i2csensor1.2)